# Altium schematic sheet Consumer.SchDoc
size A4
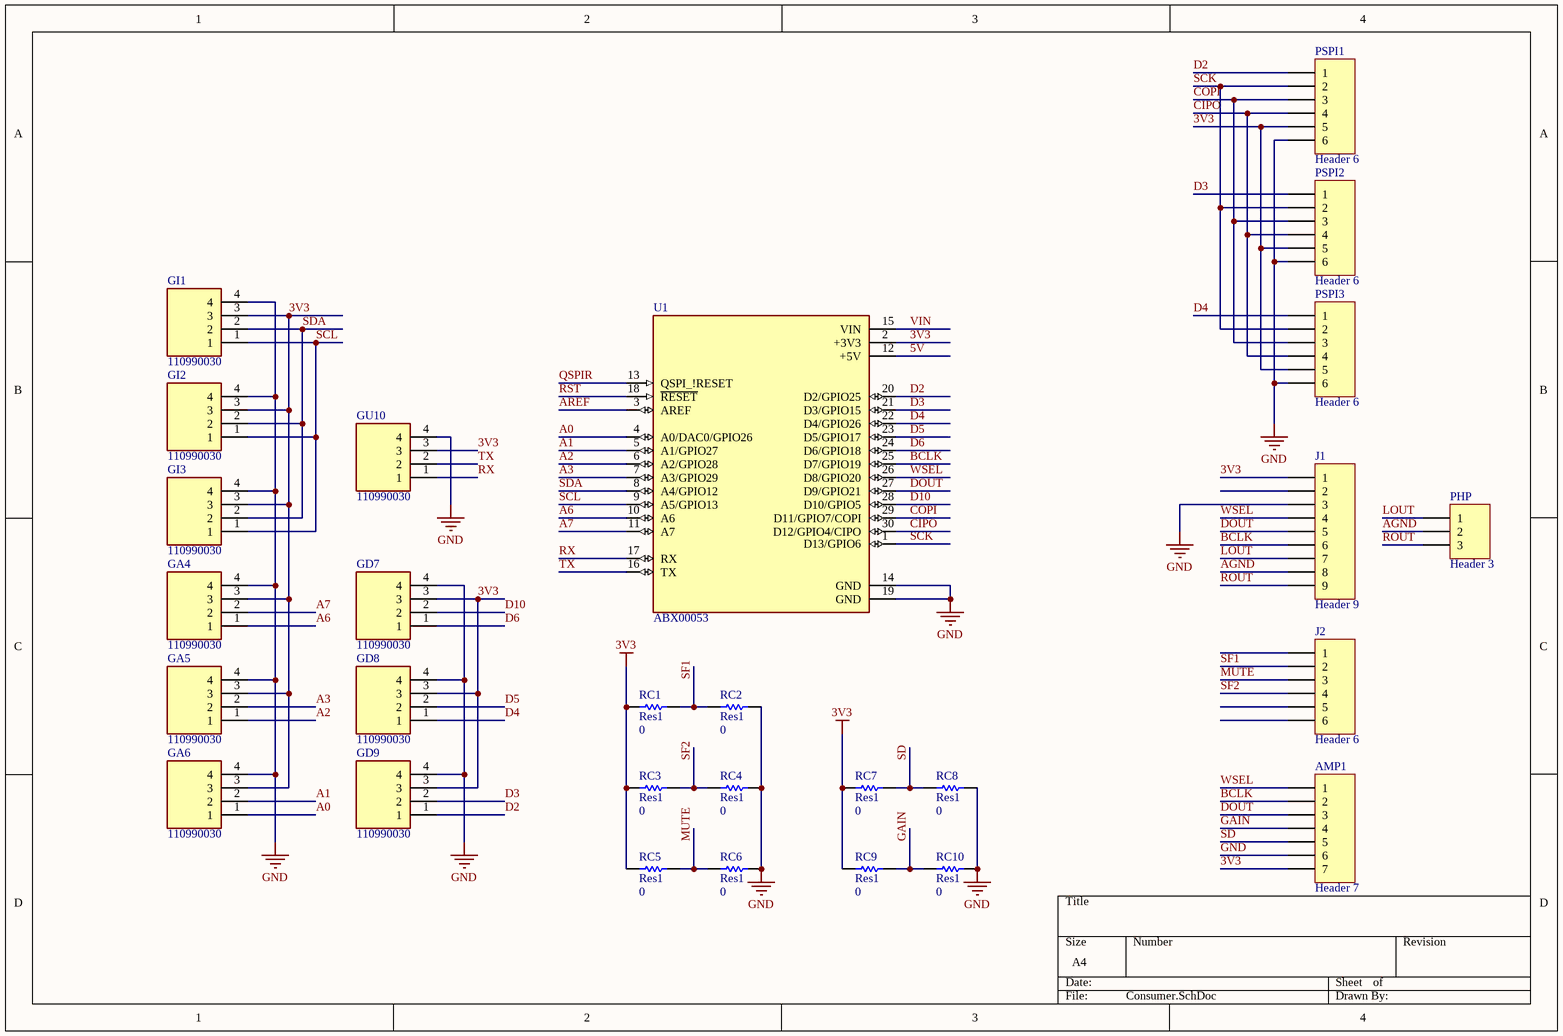
[diagram p0: Consumer.SchDoc]

## Parts
AMP1  Header 7  [HDR1X7]
GA4  110990030  [SEEED_110990030]
GA5  110990030  [SEEED_110990030]
GA6  110990030  [SEEED_110990030]
GD7  110990030  [SEEED_110990030]
GD8  110990030  [SEEED_110990030]
GD9  110990030  [SEEED_110990030]
GI1  110990030  [SEEED_110990030]
GI2  110990030  [SEEED_110990030]
GI3  110990030  [SEEED_110990030]
GU10  110990030  [SEEED_110990030]
J1  Header 9  [HDR1X9]
J2  Header 6  [HDR1X6]
PHP  Header 3  [HDR1X3]
PSPI1  Header 6  [HDR1X6]
PSPI2  Header 6  [HDR1X6]
PSPI3  Header 6  [HDR1X6]
RC1  Res1  value 0  [0603R-GENERIC]
RC2  Res1  value 0  [0603R-GENERIC]
RC3  Res1  value 0  [0603R-GENERIC]
RC4  Res1  value 0  [0603R-GENERIC]
RC5  Res1  value 0  [0603R-GENERIC]
RC6  Res1  value 0  [0603R-GENERIC]
RC7  Res1  value 0  [0603R-GENERIC]
RC8  Res1  value 0  [0603R-GENERIC]
RC9  Res1  value 0  [0603R-GENERIC]
RC10  Res1  value 0  [0603R-GENERIC]
U1  ABX00053  [MODULE_ABX00053]

## Nets
3V3: AMP1.7 GA4.3 GA5.3 GA6.3 GD7.3 GD8.3 GD9.3 GI1.3 GI2.3 GI3.3 GU10.3 J1.1 PSPI1.5 PSPI2.5 PSPI3.5 RC1.1 RC3.1 RC5.1 RC7.1 RC9.1 U1.2(+3V3)
GND: AMP1.6 GA4.4 GA5.4 GA6.4 GD7.4 GD8.4 GD9.4 GI1.4 GI2.4 GI3.4 GU10.4 J1.3 PSPI1.6 PSPI2.6 PSPI3.6 RC2.2 RC4.2 RC6.2 RC8.2 RC10.2 U1.14(GND) U1.19(GND)
5V: U1.12(+5V)
A0: GA6.1 U1.4(A0/DAC0/GPIO26)
A1: GA6.2 U1.5(A1/GPIO27)
A2: GA5.1 U1.6(A2/GPIO28)
A3: GA5.2 U1.7(A3/GPIO29)
A6: GA4.1 U1.10(A6)
A7: GA4.2 U1.11(A7)
AGND: J1.8 PHP.2
AREF: U1.3(AREF)
BCLK: AMP1.2 J1.6 U1.25(D7/GPIO19)
CIPO: PSPI1.4 PSPI2.4 PSPI3.4 U1.30(D12/GPIO4/CIPO)
COPI: PSPI1.3 PSPI2.3 PSPI3.3 U1.29(D11/GPIO7/COPI)
D2: GD9.1 PSPI1.1 U1.20(D2/GPIO25)
D3: GD9.2 PSPI2.1 U1.21(D3/GPIO15)
D4: GD8.1 PSPI3.1 U1.22(D4/GPIO26)
D5: GD8.2 U1.23(D5/GPIO17)
D6: GD7.1 U1.24(D6/GPIO18)
D10: GD7.2 U1.28(D10/GPIO5)
DOUT: AMP1.3 J1.5 U1.27(D9/GPIO21)
GAIN: AMP1.4 RC9.2 RC10.1
LOUT: J1.7 PHP.1
MUTE: J2.3 RC5.2 RC6.1
QSPIR: U1.13(QSPI_!RESET)
ROUT: J1.9 PHP.3
RST: U1.18(~{RESET})
RX: GU10.1 U1.17(RX)
SCK: PSPI1.2 PSPI2.2 PSPI3.2 U1.1(D13/GPIO6)
SCL: GI1.1 GI2.1 GI3.1 U1.9(A5/GPIO13)
SD: AMP1.5 RC7.2 RC8.1
SDA: GI1.2 GI2.2 GI3.2 U1.8(A4/GPIO12)
SF1: J2.2 RC1.2 RC2.1
SF2: J2.4 RC3.2 RC4.1
TX: GU10.2 U1.16(TX)
VIN: U1.15(VIN)
WSEL: AMP1.1 J1.4 U1.26(D8/GPIO20)

Not connected (* = marked no-connect by the designer): J1 2; J2 1 5 6

## Library data of the parts
AMP1 = Header 7: Header, 7-Pin; LatestRevisionDate: 17-Jul-2002; LatestRevisionNote: Re-released for DXP Platform.; Publisher: Altium Limited
GA4-GA6 GD7-GD9 GI1-GI3 GU10 = 110990030: GROVE 2MM 4PIN VERT CONN 10PCS; MF: Seeed Technology; Arrow_Electronics-Purchase-URL: https://snapeda.com/shop?store=Arrow+Electronics&id=583576; Availability: Good; Package: None; Price: None; Mouser-Purchase-URL: https://snapeda.com/shop?store=Mouser&id=583576; MP: 110990030; SnapEDA_Link: https://www.snapeda.com/parts/110990030/Seeed%20Technology%20Co.,%20Ltd/view-part/583576/?ref=snap; Value: *
J1 = Header 9: Header, 9-Pin; LatestRevisionDate: 17-Jul-2002; LatestRevisionNote: Re-released for DXP Platform.; Publisher: Altium Limited
J2 PSPI1-PSPI3 = Header 6: Header, 6-Pin; LatestRevisionDate: 17-Jul-2002; LatestRevisionNote: Re-released for DXP Platform.; Publisher: Altium Limited
PHP = Header 3: Header, 3-Pin; LatestRevisionDate: 17-Jul-2002; LatestRevisionNote: Re-released for DXP Platform.; Publisher: Altium Limited
RC1-RC10 = Res1: Resistor; Published: 8-Jun-2000; LatestRevisionDate: 17-Jul-2002; LatestRevisionNote: Re-released for DXP Platform.; PackageReference: AXIAL-0.3; Publisher: Altium Limited; PackageDescription: Axial Device, Thru-Hole; 2 Leads; 0.3 in Pin Spacing
U1 = ABX00053: ARDUINO NANO RP2040 CONNECT WITH; MF: Arduino; SnapEDA_Link: https://www.snapeda.com/parts/ABX00053/Arduino/view-part/6098734/?ref=snap; Package: None; MP: ABX00053; Price: None; Availability: In Stock; Check_prices: https://www.snapeda.com/parts/ABX00053/Arduino/view-part/6098734/?ref=eda; Value: *